# EAGLE design main (EAGLE 6.4)
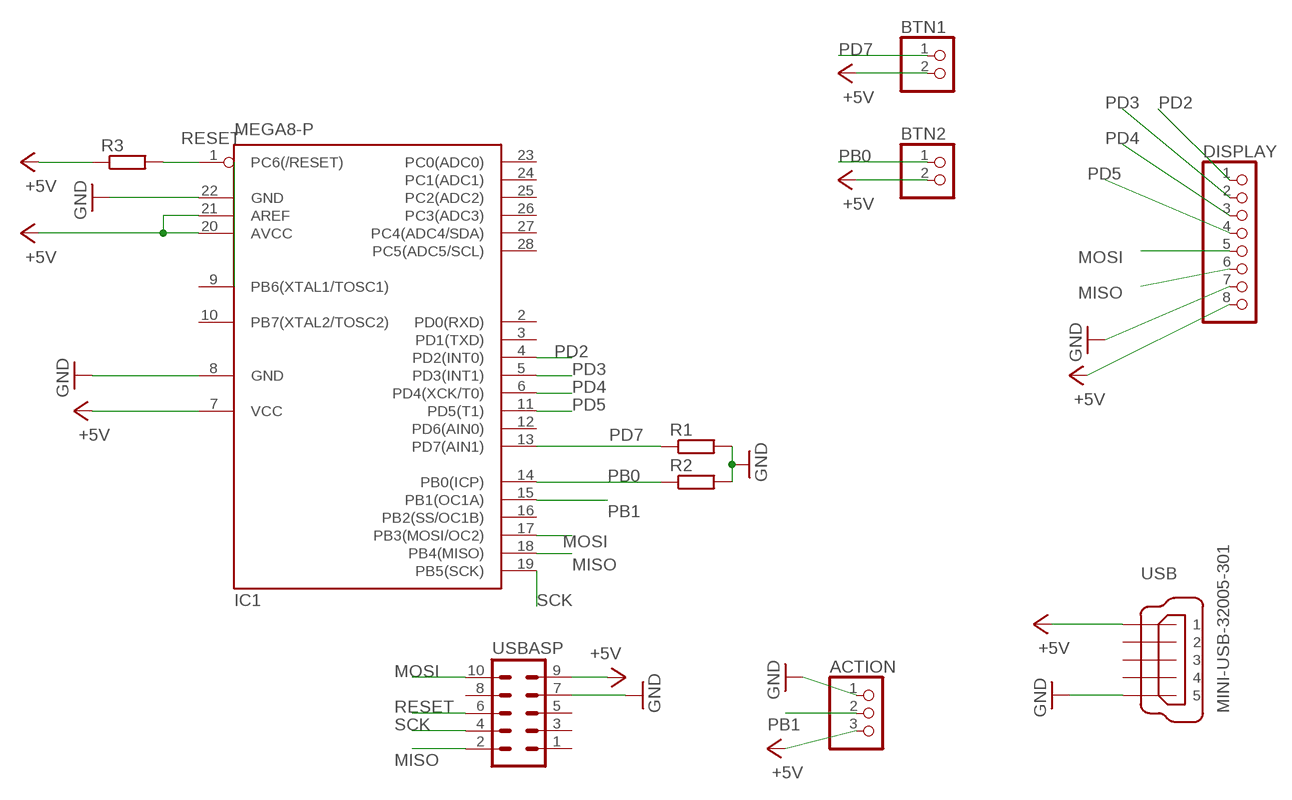
[diagram p0: schematic, sheet 1]

## Parts
ACTION  PINHD-1X3  [1X03]
BTN1  PINHD-1X2  [1X02]
BTN2  PINHD-1X2  [1X02]
DISPLAY  PINHD-1X8  [1X08]
IC1  MEGA8-P  [DIL28-3]
R1  R-EU_0207/7  [0207/7]
R2  R-EU_0207/7  [0207/7]
R3  R-EU_0207/7  [0207/7]
USB  MINI-USB-32005-301  [32005-301]
USBASP  MA05-2  [MA05-2]

## Nets
+5V: ACTION.3 BTN1.2 BTN2.2 DISPLAY.8 IC1.7(VCC) IC1.20(AVCC) IC1.21(AREF) R3.1 USB.1 USBASP.9
GND: ACTION.1 DISPLAY.7 IC1.8(GND) IC1.22(GND) R1.2 R2.2 USB.5 USBASP.7
MISO: DISPLAY.6 IC1.18(PB4(MISO)) USBASP.2
MOSI: DISPLAY.5 IC1.17(PB3(MOSI/OC2)) USBASP.10
PB0: BTN2.1 IC1.14(PB0(ICP)) R2.1
PB1: ACTION.2 IC1.15(PB1(OC1A))
PD2: DISPLAY.1 IC1.4(PD2(INT0))
PD3: DISPLAY.2 IC1.5(PD3(INT1))
PD4: DISPLAY.3 IC1.6(PD4(XCK/T0))
PD5: DISPLAY.4 IC1.11(PD5(T1))
PD7: BTN1.1 IC1.13(PD7(AIN1)) R1.1
RESET: IC1.1(PC6(/RESET)) R3.2 USBASP.6
SCK: IC1.19(PB5(SCK)) USBASP.4
Unconnected: IC1.2(PD0(RXD)) IC1.3(PD1(TXD)) IC1.9(PB6(XTAL1/TOSC1)) IC1.10(PB7(XTAL2/TOSC2)) IC1.12(PD6(AIN0)) IC1.16(PB2(SS/OC1B)) IC1.23(PC0(ADC0)) IC1.24(PC1(ADC1)) IC1.25(PC2(ADC2)) IC1.26(PC3(ADC3)) IC1.27(PC4(ADC4/SDA)) IC1.28(PC5(ADC5/SCL)) USB.2 USB.3 USB.4 USBASP.1 USBASP.3 USBASP.5 USBASP.8

## Library data of the parts
ACTION = pinhead:PINHD-1X3: PIN HEADER
BTN1 BTN2 = pinhead:PINHD-1X2: PIN HEADER
DISPLAY = pinhead:PINHD-1X8: PIN HEADER
IC1 = atmel:MEGA8-P: MICROCONTROLLER 8 Kbytes FLASH, 1 kbytes SRAM, 512 bytes EEPROM, USART, 4-channel 10 bit ADC, 2-channel 8 bit ADC Pin compatible with Atmega48, ATMega88, ATMega168 Source: avr.lbr; OC_FARNELL: unknown; OC_NEWARK: unknown
R1-R3 = resistor:R-EU_: RESISTOR, European symbol
USB = con-cypressindustries:MINI-USB-: MINI USB-B Conector Source: www.cypressindustries.com; OC_FARNELL: unknown; OC_NEWARK: unknown
USBASP = con-lstb:MA05-2: PIN HEADER; OC_FARNELL: unknown; OC_NEWARK: unknown

## Board
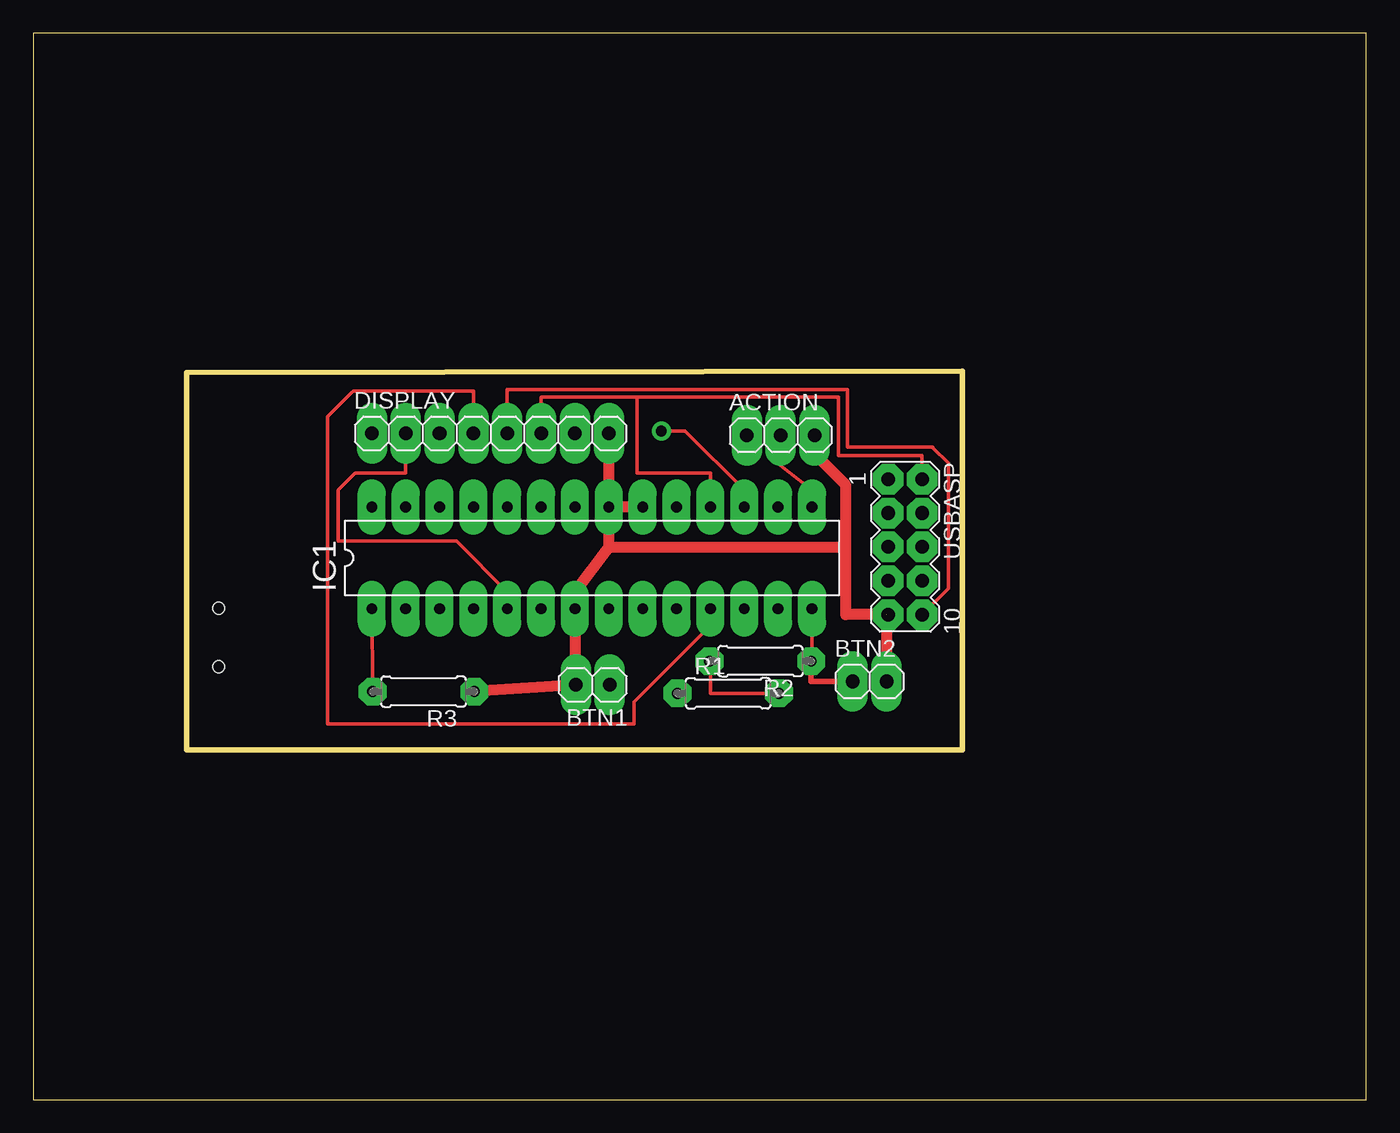
[diagram p1: board, top side]
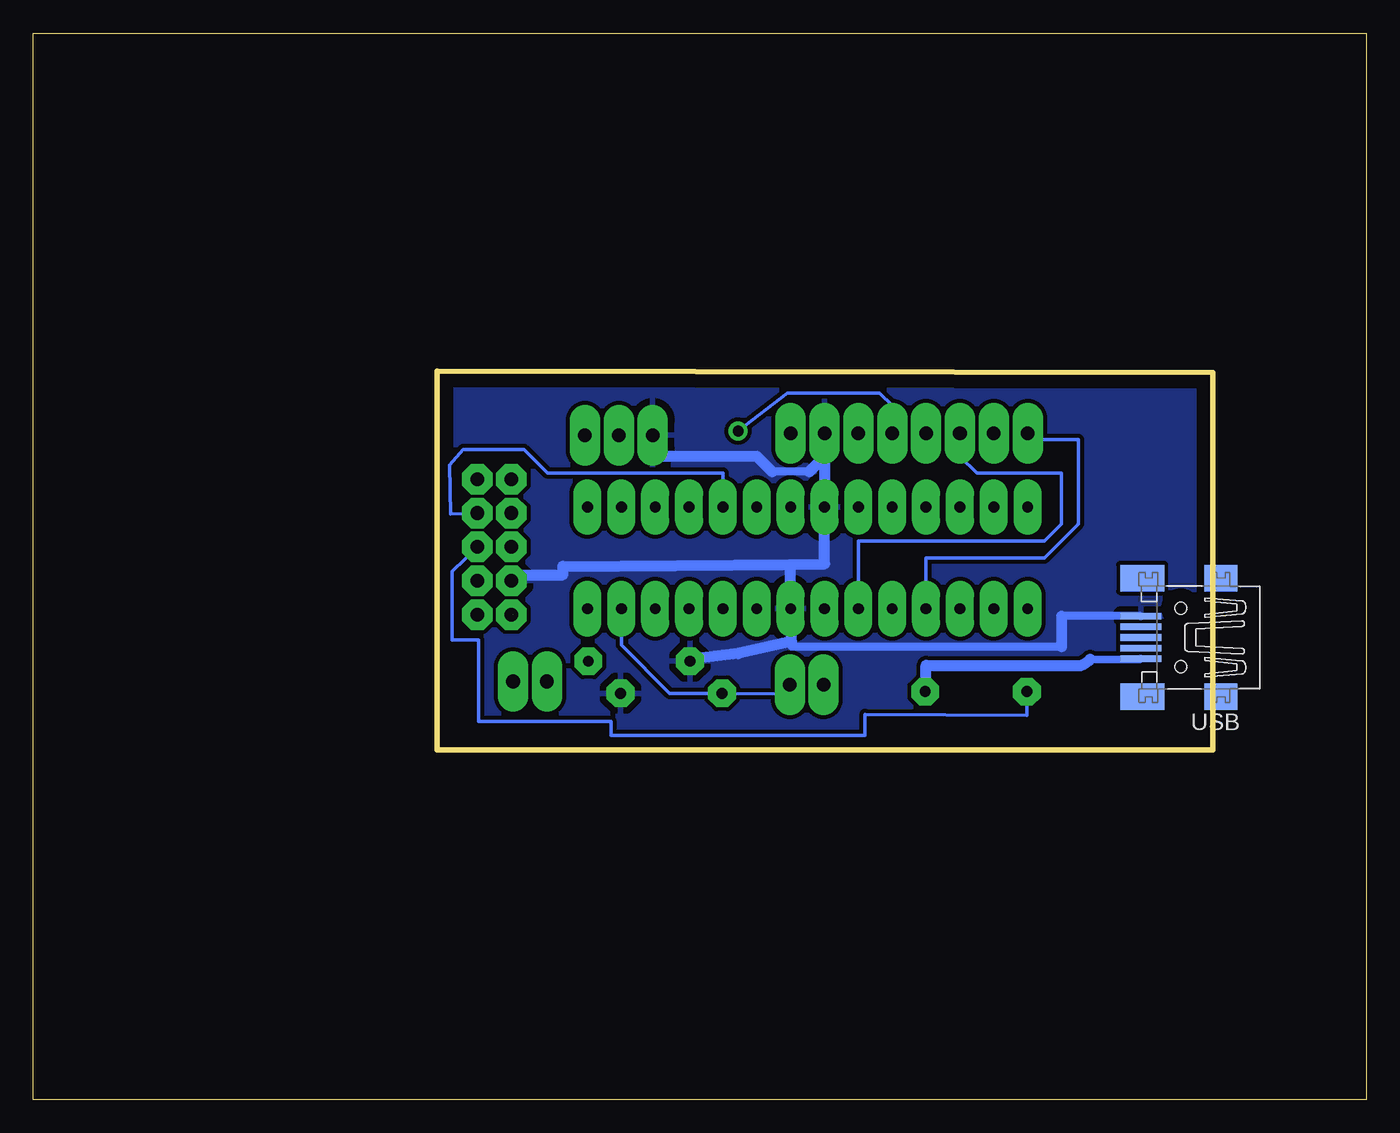
[diagram p2: board, bottom side, seen from below]

Size 100 x 80 mm. Coordinates in mm from the lower left corner, seen from the top.
Outline: 0,0 100,0 100,80 0,80 0,0
Outline: 11.49,26.23 69.72,26.23 69.72,54.67 11.49,54.55 11.49,26.23
Copper layers (1*16): Top 0.035mm / dielectric 1.5mm / Bottom 0.035mm
Design rules "default": minimum track width 10mil, minimum drill 32mil, track to track 12mil, track to pad 12mil, pad to pad 12mil, via to via 12mil, smd to smd 12mil, copper to edge 40mil, drill to drill 40mil, minimum pad ring 25mil, minimum via ring 12mil, stop-mask expansion 4mil, vias tented up to drill 0mil, thermal gap 20mil

### Footprints (pad centres in the part's own frame; a part is rotated, then mirrored left to right if it is on the bottom)
1X03 = drill 1.016 long: 1 -2.54,0; 2 0,0; 3 2.54,0
1X02 = drill 1.016 long: 1 -1.27,0; 2 1.27,0
1X08 = drill 1.016 long: 1 -8.89,0; 2 -6.35,0; 3 -3.81,0; 4 -1.27,0; 5 1.27,0; 6 3.81,0; 7 6.35,0; 8 8.89,0
DIL28-3 = drill 0.813 long: 1 -16.51,-3.81; 2 -13.97,-3.81; 3 -11.43,-3.81; 4 -8.89,-3.81; 5 -6.35,-3.81; 6 -3.81,-3.81; 7 -1.27,-3.81; 8 1.27,-3.81; 9 3.81,-3.81; 10 6.35,-3.81; 11 8.89,-3.81; 12 11.43,-3.81; 13 13.97,-3.81; 14 16.51,-3.81; 15 16.51,3.81; 16 13.97,3.81; 17 11.43,3.81; 18 8.89,3.81; 19 6.35,3.81; 20 3.81,3.81; 21 1.27,3.81; 22 -1.27,3.81; 23 -3.81,3.81; 24 -6.35,3.81; 25 -8.89,3.81; 26 -11.43,3.81; 27 -13.97,3.81; 28 -16.51,3.81
0207/7 = drill 0.813 octagon: 1 -3.81,0; 2 3.81,0
32005-301 = smd 3.1 x 0.5: 1 3,1.6; 2 3,0.8; 3 3,0; 4 3,-0.8; 5 3,-1.6 | smd 2.5 x 2: M1 -3,-4.45; M2 -3,4.45 | smd 3.3 x 2: M3 2.9,4.45; M4 2.9,-4.45 | hole 0.9: 0,2.2; 0,-2.2
MA05-2 = drill 1.016 octagon: 1 -5.08,-1.27; 2 -5.08,1.27; 3 -2.54,-1.27; 4 -2.54,1.27; 5 0,-1.27; 6 0,1.27; 7 2.54,-1.27; 8 2.54,1.27; 9 5.08,-1.27; 10 5.08,1.27

### Placement (x,y rotation side)
ACTION  56.07,49.85 0 top
BTN1  41.97,31.11 180 top
BTN2  62.74,31.37 0 top
DISPLAY  34.29,49.97 0 top
IC1  41.91,40.64 0 top
R1  52.13,30.48 0 top
R2  54.55,32.89 180 top
R3  29.27,30.61 180 top
USB  13.91,34.67 180 bottom
USBASP  65.41,41.47 270 top

### Tracks (layer width: path | path; a pad name or v marks a point on that pad's centre or on a via)
+5V  (1 unrouted)
  Top 0.813: USBASP.9 60.96,36.39 60.96,41.47 | 60.96,41.47 60.96,46.1 58.61,48.45 ACTION.3 | IC1.20 IC1.21 | IC1.21 DISPLAY.8 | R3.1 BTN1.2 IC1.7 40.64,38.1 43.18,41.47 | 43.18,41.47 IC1.21 | 43.18,41.47 60.96,41.47 | 64.01,36.39 BTN2.2
  Bottom 0.406: USBASP.9 64.01,36.39
  Bottom 0.61: 20.7,33.02 20.78,33.02 USB.1
  Bottom 0.813: R3.1 33.02,32.58 21.34,32.58 20.7,33.02
GND
  Top 0.254: R1.2 50.8,30.48 50.8,33.02 R2.2
  Bottom 0.254: DISPLAY.7 40.64,48.26 | USBASP.7 63.69,39.37 | 50.8,33.02 R2.2
  Bottom 0.406: 43.12,33.97 43.12,34.35
  Bottom 0.61: 41.78,47.12 44.58,47.12 | USB.5 22.86,36.27 | 22.86,33.97 43.12,33.97
  Bottom 0.813: DISPLAY.7 IC1.22 40.64,40.2 43.24,40.13 | 44.58,47.12 45.72,48.26 53.53,48.26 ACTION.1 | 40.64,48.26 41.78,47.12 | 43.24,40.13 IC1.8 43.12,34.35 47.12,33.47 50.8,33.02 | 63.69,39.37 60.26,39.37 60.26,40.01 43.24,40.13 | 22.86,36.27 22.86,33.97
  pour Bottom: 11.49,54.42 69.72,54.61 69.72,26.35 11.62,26.16 11.49,54.29
MISO
  Top 0.254: IC1.18 50.8,46.99 45.28,46.99 45.28,52.7 | 45.28,52.7 38.1,52.7 DISPLAY.6 | USBASP.2 66.67,48.32 60.39,48.32 60.39,52.7 45.28,52.7
MOSI  (via drill 0.81)
  Top 0.254: IC1.17 53.34,45.72 48.9,50.16 v47.12,50.16 | USBASP.10 68.64,38.35 68.64,47.75 67.5,48.9 67.5,48.96 61.09,48.96 61.09,53.28 35.56,53.28 DISPLAY.5
  Bottom 0.254: v47.12,50.16 43.43,53.02 36.51,53.02 35.56,52.07 DISPLAY.5
PB0
  Top 0.254: IC1.14 58.42,33.02 R2.1
  Top 0.406: BTN2.1 58.36,31.37 R2.1
PB1
  Top 0.254: IC1.15 58.42,45.72 56.07,47.56 ACTION.2
PD2
  Bottom 0.254: IC1.4 33.02,40.64 24.13,40.64 21.59,43.18 21.59,49.53 25.4,49.53 DISPLAY.1
PD3
  Top 0.254: IC1.5 35.56,38.1 31.75,41.91 22.86,41.91 22.86,45.72 24.13,46.99 27.94,46.99 DISPLAY.2
PD4
  Bottom 0.254: IC1.6 38.1,41.91 24.13,41.91 22.86,43.18 22.86,46.99 29.21,46.99 30.48,48.26 DISPLAY.3
PD5
  Top 0.254: IC1.11 50.8,35.56 45.09,29.84 45.09,28.19 22.1,28.19 22.1,51.24 24,53.15 33.02,53.15 DISPLAY.4
PD7
  Bottom 0.254: BTN1.1 43.24,30.42 R1.1 52.26,30.48 55.88,34.1 IC1.13
RESET
  Top 0.254: IC1.1 R3.2
  Bottom 0.254: USBASP.6 68.58,39.62 68.58,34.48 66.61,34.48 66.61,28.38 56.64,28.38 56.64,27.3 37.59,27.3 37.59,28.89 25.46,28.83 R3.2
SCK
  Bottom 0.254: IC1.19 48.26,46.99 61.4,46.99 63.18,48.77 67.75,48.77 68.77,47.62 68.71,43.94 USBASP.4